# EAGLE design webserver (EAGLE 5.09)
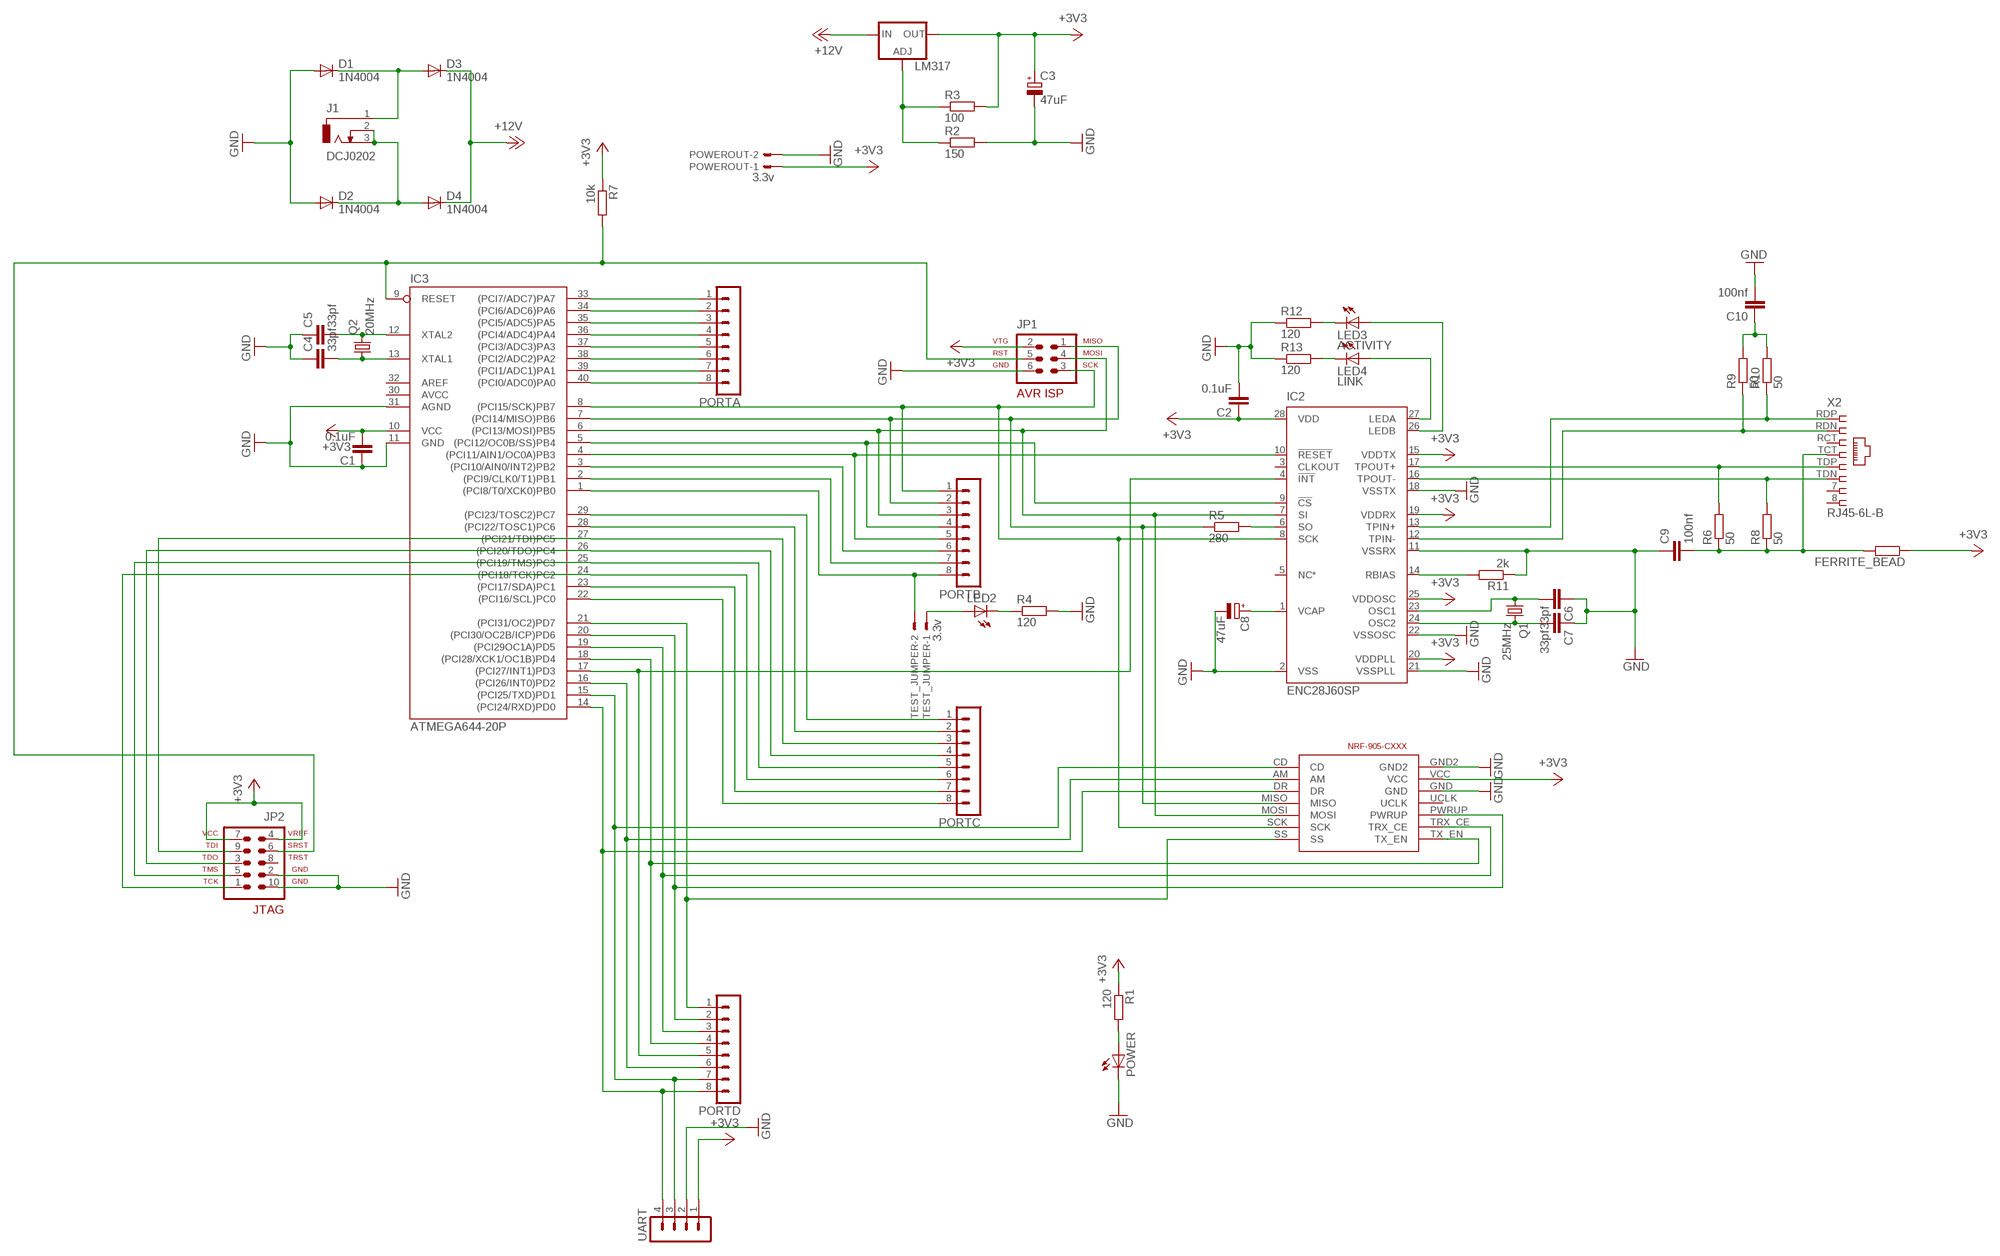
[diagram p0: schematic, sheet 1]

## Parts
C1  0.1uF  C-EU025-024X044  [C025-024X044]
C2  0.1uF  C-EU025-024X044  [C025-024X044]
C3  47uF  CPOL-EUE5-8.5  [E5-8,5]
C4  33pf  C-EU025-024X044  [C025-024X044]
C5  33pf  C-EU025-024X044  [C025-024X044]
C6  33pf  C-EU025-024X044  [C025-024X044]
C7  33pf  C-EU025-024X044  [C025-024X044]
C8  47uF  CPOL-EUE5-8.5  [E5-8,5]
C9  100nf  C-EU025-024X044  [C025-024X044]
C10  100nf  C-EU025-024X044  [C025-024X044]
D1  1N4004  [DO41-10]
D2  1N4004  [DO41-10]
D3  1N4004  [DO41-10]
D4  1N4004  [DO41-10]
FERRITE_BEAD  R-EU_0204/7  [0204/7]
IC2  ENC28J60SP  [DIL28-3]
IC3  ATMEGA644-20P  [DIL40]
J1  DCJ0202  [DCJ0202]
JP1  AVR-ISP-6  [AVR-ISP-6]
JP2  AVR-JTAG-10  [AVR-JTAG-10]
LED2  LED3MM  [LED3MM]
LED3  ACTIVITY  LED3MM  [LED3MM]
LED4  LINK  LED3MM  [LED3MM]
LM317  LM317TS  [317TS]
PORTA  MA08-1  [MA08-1]
PORTB  MA08-1  [MA08-1]
PORTC  MA08-1  [MA08-1]
PORTD  MA08-1  [MA08-1]
POWER  LED3MM  [LED3MM]
POWEROUT  3.3v  22-23-2021  [22-23-2021]
Q1  25MHz  CRYTALHC49S  [HC49/S]
Q2  20MHz  CRYTALHC49S  [HC49/S]
R1  120  R-EU_0204/7  [0204/7]
R2  150  R-EU_0204/7  [0204/7]
R3  100  R-EU_0204/7  [0204/7]
R4  120  R-EU_0204/7  [0204/7]
R5  280  R-EU_0204/7  [0204/7]
R6  50  R-EU_0204/7  [0204/7]
R7  10k  R-EU_0204/7  [0204/7]
R8  50  R-EU_0204/7  [0204/7]
R9  50  R-EU_0204/7  [0204/7]
R10  50  R-EU_0204/7  [0204/7]
R11  2k  R-EU_0204/7  [0204/7]
R12  120  R-EU_0204/7  [0204/7]
R13  120  R-EU_0204/7  [0204/7]
TEST_JUMPER  3.3v  22-23-2021  [22-23-2021]
U$1  NRF-905-CXXX  [NRF905-CXXX]
UART  MA04-1  [MA04-1]
X2  RJ45-6L-B  [RJ45-NO-SHIELD]

## Nets
+3V3: C1.2 C2.1 C3.+ FERRITE_BEAD.1 IC2.15(VDDTX) IC2.19(VDDRX) IC2.20(VDDPLL) IC2.25(VDDOSC) IC2.28(VDD) IC3.10(VCC) JP1.2 JP2.4 JP2.7 LM317.2(OUT) POWEROUT.1 R1.1 R3.2 R7.1 U$1.VCC UART.1
+12V: D3.C D4.C LM317.3(IN)
GND: C1.1 C2.2 C3.- C4.1 C5.1 C6.1 C7.1 C8.- C9.1 C10.2 D1.A D2.A IC2.2(VSS) IC2.11(VSSRX) IC2.18(VSSTX) IC2.21(VSSPLL) IC2.22(VSSOSC) IC3.11(GND) IC3.31(AGND) JP1.6 JP2.2 JP2.10 POWER.K(C) POWEROUT.2 R2.2 R4.2 R11.1 R12.1 R13.1 U$1.GND U$1.GND2 UART.2
N$1: IC3.29((PCI23/TOSC2)PC7) PORTC.1
N$2: IC3.28((PCI22/TOSC1)PC6) PORTC.2
N$3: IC3.27((PCI21/TDI)PC5) JP2.9 PORTC.3
N$4: IC3.26((PCI20/TDO)PC4) JP2.3 PORTC.4
N$5: IC3.25((PCI19/TMS)PC3) JP2.5 PORTC.5
N$6: IC3.24((PCI18/TCK)PC2) JP2.1 PORTC.6
N$7: IC3.23((PCI17/SDA)PC1) PORTC.7
N$8: IC3.22((PCI16/SCL)PC0) PORTC.8
N$9: IC3.33((PCI7/ADC7)PA7) PORTA.1
N$10: LM317.1(ADJ) R2.1 R3.1
N$11: IC2.9(!CS) IC3.5((PCI12/OC0B/SS)PB4) PORTB.4
N$12: IC3.7((PCI14/MISO)PB6) JP1.1 PORTB.2 R5.1 U$1.MISO
N$13: IC2.7(SI) IC3.6((PCI13/MOSI)PB5) JP1.4 PORTB.3 U$1.MOSI
N$14: POWER.A R1.2
N$15: IC3.21((PCI31/OC2)PD7) PORTD.1 U$1.SS
N$16: IC3.14((PCI24/RXD)PD0) PORTD.8 U$1.DR UART.4
N$17: IC2.8(SCK) IC3.8((PCI15/SCK)PB7) JP1.3 PORTB.1 U$1.SCK
N$18: C7.2 IC2.24(OSC2) Q1.2
N$19: C6.2 IC2.23(OSC1) Q1.1
N$20: IC3.9(RESET) JP1.5 JP2.6 R7.2
N$21: C8.+ IC2.1(VCAP)
N$23: C5.2 IC3.12(XTAL2) Q2.2
N$24: IC3.15((PCI25/TXD)PD1) PORTD.7 U$1.CD UART.3
N$25: IC2.10(!RESET) IC3.4((PCI11/AIN1/OC0A)PB3) PORTB.5
N$26: C4.2 IC3.13(XTAL1) Q2.1
N$27: IC3.34((PCI6/ADC6)PA6) PORTA.2
N$28: IC3.35((PCI5/ADC5)PA5) PORTA.3
N$29: IC3.36((PCI4/ADC4)PA4) PORTA.4
N$30: IC3.37((PCI3/ADC3)PA3) PORTA.5
N$31: IC3.38((PCI2/ADC2)PA2) PORTA.6
N$32: IC3.39((PCI1/ADC1)PA1) PORTA.7
N$33: IC3.40((PCI0/ADC0)PA0) PORTA.8
N$34: IC3.1((PCI8/T0/XCK0)PB0) PORTB.8 TEST_JUMPER.2
N$35: IC3.2((PCI9/CLK0/T1)PB1) PORTB.7
N$36: IC3.3((PCI10/AIN0/INT2)PB2) PORTB.6
N$37: IC2.6(SO) R5.2
N$38: IC3.20((PCI30/OC2B/ICP)PD6) PORTD.2 U$1.PWRUP
N$39: IC3.19((PCI29OC1A)PD5) PORTD.3 U$1.TRX_CE
N$40: IC3.18((PCI28/XCK1/OC1B)PD4) PORTD.4 U$1.TX_EN
N$41: IC2.4(!INT) IC3.17((PCI27/INT1)PD3) PORTD.5
N$42: IC3.16((PCI26/INT0)PD2) PORTD.6 U$1.AM
N$44: D2.C D4.A J1.2 J1.3
N$45: D1.C D3.A J1.1
N$46: LED2.K(C) R4.1
N$47: LED2.A TEST_JUMPER.1
N$48: C9.2 FERRITE_BEAD.2 R6.1 R8.1 X2.TCT
N$49: IC2.16(TPOUT-) R8.2 X2.TDN
N$50: IC2.17(TPOUT+) R6.2 X2.TDP
N$51: C10.1 R9.2 R10.2
N$52: IC2.13(TPIN+) R10.1 X2.RDP
N$53: IC2.12(TPIN-) R9.1 X2.RDN
N$54: IC2.14(RBIAS) R11.2
N$55: IC2.27(LEDA) LED4.A
N$56: IC2.26(LEDB) LED3.A
N$57: LED4.K(C) R13.2
N$58: LED3.K(C) R12.2
Unconnected: IC2.3(CLKOUT) IC2.5(NC*) JP2.8 U$1.UCLK X2.7 X2.8 X2.RCT

## Power pins joined to a net without a drawn wire
AREF: IC3.32(AREF)
AVCC: IC3.30(AVCC)

## Library data of the parts
C1 C2 C4-C7 C9 C10 = rcl:C-EU: CAPACITOR, European symbol
C3 C8 = rcl:CPOL-EU: POLARIZED CAPACITOR, European symbol
D1-D4 = diode:1N4004: DIODE general purpose rectifier, 1 A
FERRITE_BEAD R1-R13 = rcl:R-EU_: RESISTOR, European symbol
IC2 = microchip:ENC28J60: Stand-Alone Ethernet Controller with SPI Interface Source: http://ww1.microchip.com/downloads/en/DeviceDoc/39662c.pdf
IC3 = avr:ATMEGA644*P: MICROCONTROLLER 64 kBytes FLASH 4 kBytes SRAM 2 kBytes EEPROM DUAL USART 8-channel 10 bit ADC
J1 = con-jack:DCJ0202: DC POWER JACK Source: DCJ0202.pdf
JP1 = atmel-isp:AVR-ISP-6: AVR ISP-6 Serial Programming Header
JP2 = avr-4:AVR-JTAG-10: AVR JTAG Debug/Programming Header
LED2-LED4 POWER = led:LED: LED OSRAM: - CHIPLED LG R971, LG N971, LY N971, LG Q971, LY Q971, LO R971, LY R971 LH N974, LH R974 LS Q976, LO Q976, LY Q976 LO Q996 - Hyper CHIPLED LW Q18S LB Q993, LB Q99A, LB R99A - SideLED LS A670, LO A670, LY A670, LG A670, LP A670 LB A673, LV A673, LT A673, LW A673 LH A674 LY A675 LS A676, LA A676, LO A676, LY A676, LW A676 LS A679, LY A679, LG A679 - Hyper Micro SIDELED® LS Y876, LA Y876, LO Y876, LY Y876 LT Y87S - SmartLED LW L88C, LW L88S LB L89C, LB L89S, LG L890 LS L89K, LO L89K, LY L89K LS L896, LA L896, LO L896, LY L896 - TOPLED LS T670, LO T670, LY T670, LG T670, LP T670 LSG T670, LSP T670, LSY T670, LOP T670, LYG T670 LG T671, LOG T671, LSG T671 LB T673, LV T673, LT T673, LW T673 LH T674 LS T676, LA T676, LO T676, LY T676, LB T676, LH T676, LSB T676, LW T676 LB T67C, LV T67C, LT T67C, LS T67K, LO T67K, LY T67K, LW E67C LS E67B, LA E67B, LO E67B, LY E67B, LB E67C, LV E67C, LT E67C LW T67C LS T679, LY T679, LG T679 LS T770, LO T770, LY T770, LG T770, LP T770 LB T773, LV T773, LT T773, LW T773 LH T774 LS E675, LA E675, LY E675, LS T675 LS T776, LA T776, LO T776, LY T776, LB T776 LHGB T686 LT T68C, LB T68C - Hyper Mini TOPLED® LB M676 - Mini TOPLED Santana® LG M470 LS M47K, LO M47K, LY M47K Source: http://www.osram.convergy.de - LUMILED® LXK2-PW12-R00, LXK2-PW12-S00, LXK2-PW14-U00, LXK2-PW14-V00 LXK2-PM12-R00, LXK2-PM12-S00, LXK2-PM14-U00 LXK2-PE12-Q00, LXK2-PE12-R00, LXK2-PE12-S00, LXK2-PE14-T00, LXK2-PE14-U00 LXK2-PB12-K00, LXK2-PB12-L00, LXK2-PB12-M00, LXK2-PB14-N00, LXK2-PB14-P00, LXK2-PB14-Q00 LXK2-PR12-L00, LXK2-PR12-M00, LXK2-PR14-Q00, LXK2-PR14-R00 LXK2-PD12-Q00, LXK2-PD12-R00, LXK2-PD12-S00 LXK2-PH12-R00, LXK2-PH12-S00 LXK2-PL12-P00, LXK2-PL12-Q00, LXK2-PL12-R00 Source: www.luxeon.com
LM317 = v-reg:LM317TS: VOLTAGE REGULATOR
PORTA PORTB PORTC PORTD = con-lstb:MA08-1: PIN HEADER
POWEROUT TEST_JUMPER = con-molex:22-23-2021: .100" (2.54mm) Center Header - 2 Pin
Q1 Q2 = crystal:CRYTAL: CRYSTAL
U$1 = nrf905-Cxxx:NRF-905-CXXX
UART = con-lstb:MA04-1: PIN HEADER
X2 = con-tycoelectronics:RJ45: CORCOM Modular RJ Jacks No Shield Source: www.tycoelectronics.com .. ENG_DS_1654001_1099_RJ_L_0507.pdf

## Board
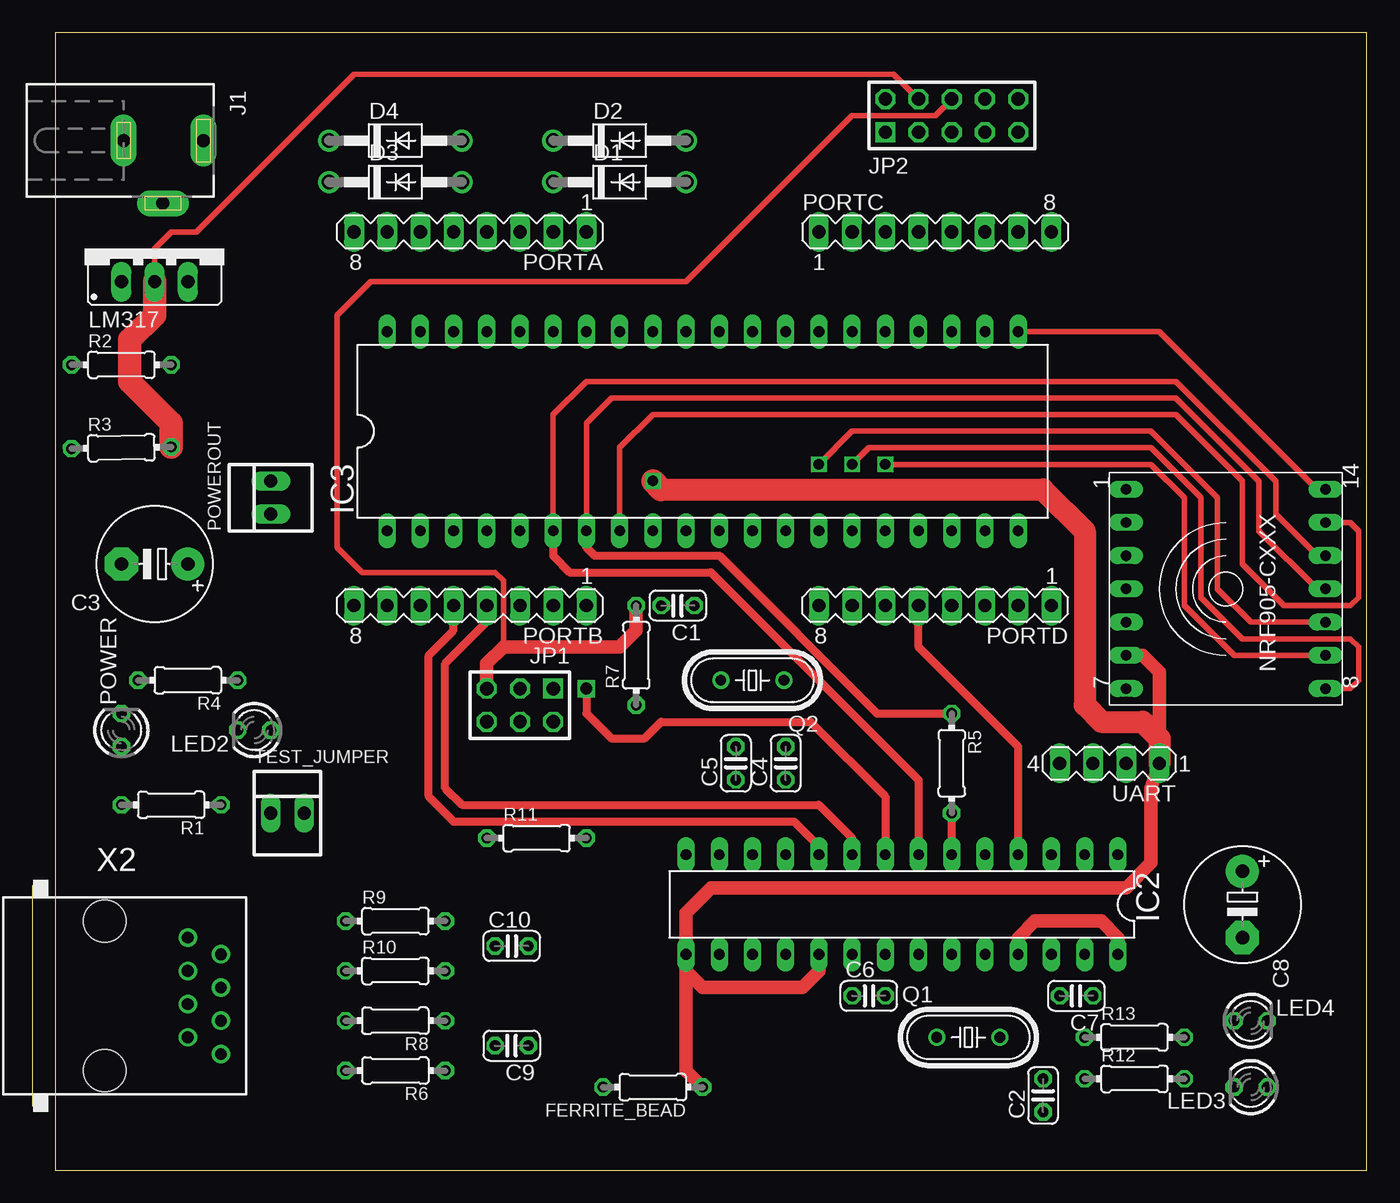
[diagram p1: board, top side]
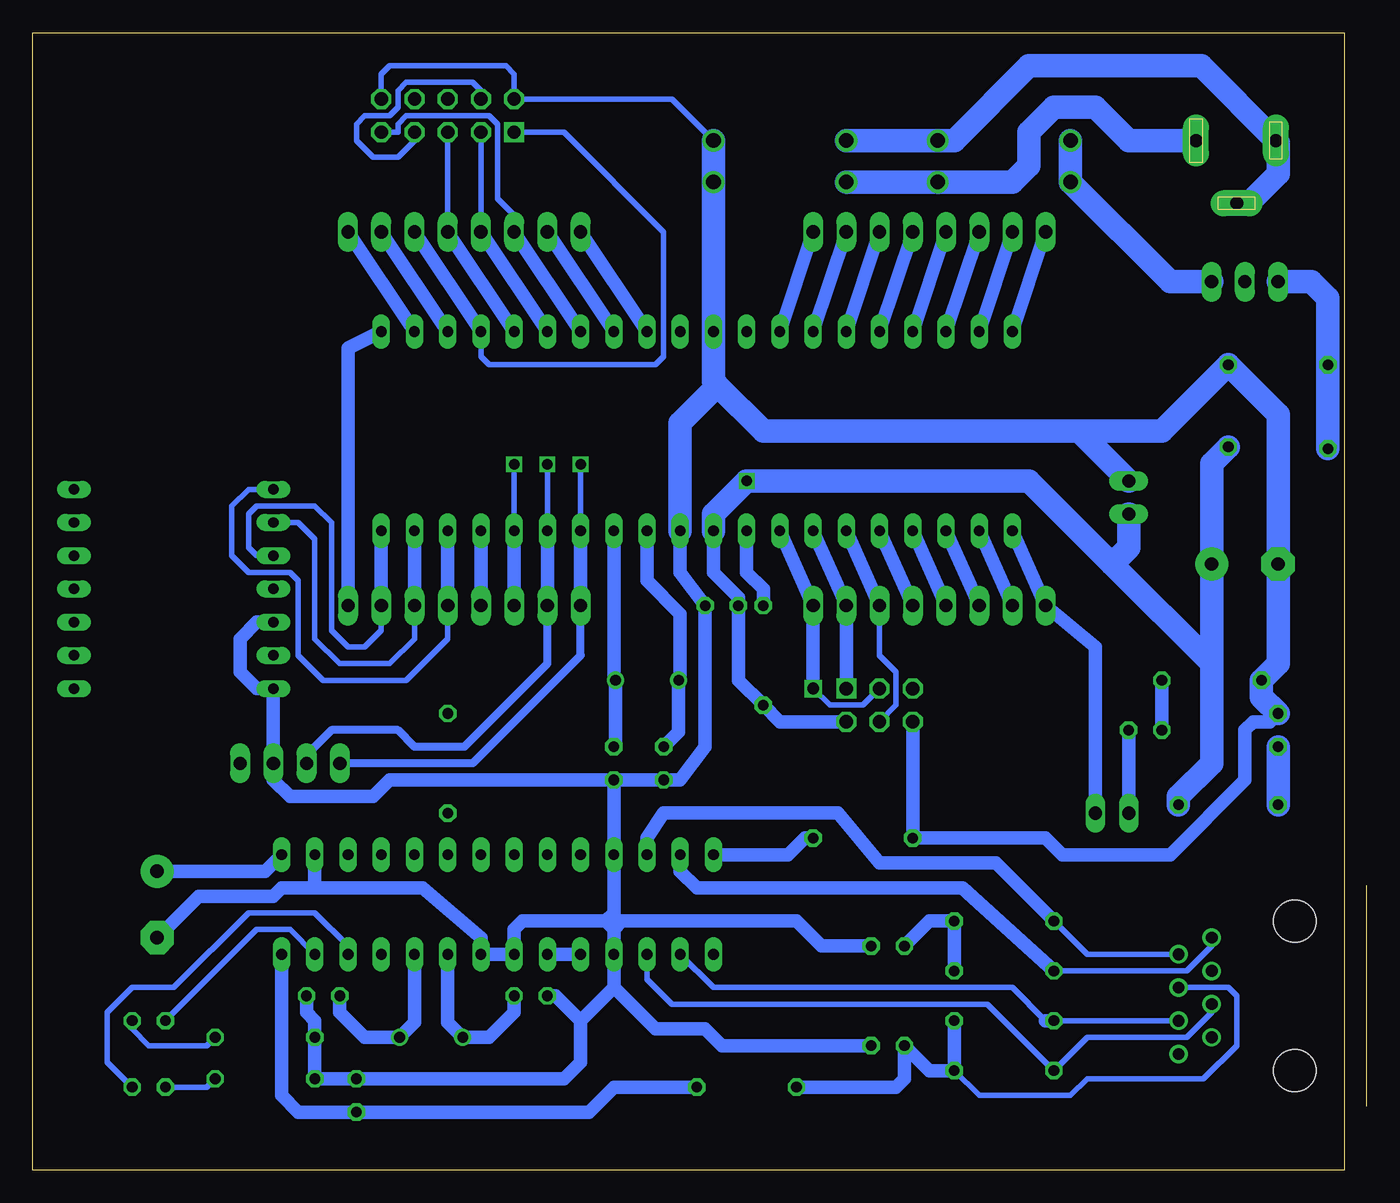
[diagram p2: board, bottom side, seen from below]

Size 100.3 x 86.98 mm. Coordinates in mm from the lower left corner, seen from the top.
Outline: 0,0 100.3,0 100.3,86.98 0,86.98 0,0
Copper layers (1*16): Top 0.035mm / dielectric 1.5mm / Bottom 0.035mm
Design rules "default": minimum track width 10mil, minimum drill 24mil, track to track 8mil, track to pad 8mil, pad to pad 8mil, via to via 8mil, smd to smd 8mil, copper to edge 10mil, drill to drill 8mil, minimum pad ring 10mil, minimum via ring 8mil, stop-mask expansion 4mil, vias tented up to drill 0mil, thermal gap 10mil

### Footprints (pad centres in the part's own frame; a part is rotated, then mirrored left to right if it is on the bottom)
C025-024X044 = drill 0.813 octagon: 1 -1.27,0; 2 1.27,0
E5-8,5 = drill 1.016 pad 2.54 round: + -2.54,0 | drill 1.016 pad 2.54 octagon: - 2.54,0
DO41-10 = drill 1.118 round: A 5.08,0; C -5.08,0
0204/7 = drill 0.813 octagon: 1 -3.81,0; 2 3.81,0
DIL28-3 = drill 0.813 long: 1 -16.51,-3.81; 2 -13.97,-3.81; 3 -11.43,-3.81; 4 -8.89,-3.81; 5 -6.35,-3.81; 6 -3.81,-3.81; 7 -1.27,-3.81; 8 1.27,-3.81; 9 3.81,-3.81; 10 6.35,-3.81; 11 8.89,-3.81; 12 11.43,-3.81; 13 13.97,-3.81; 14 16.51,-3.81; 15 16.51,3.81; 16 13.97,3.81; 17 11.43,3.81; 18 8.89,3.81; 19 6.35,3.81; 20 3.81,3.81; 21 1.27,3.81; 22 -1.27,3.81; 23 -3.81,3.81; 24 -6.35,3.81; 25 -8.89,3.81; 26 -11.43,3.81; 27 -13.97,3.81; 28 -16.51,3.81
DIL40 = drill 0.813 long: 1 -24.13,-7.62; 2 -21.59,-7.62; 3 -19.05,-7.62; 4 -16.51,-7.62; 5 -13.97,-7.62; 6 -11.43,-7.62; 7 -8.89,-7.62; 8 -6.35,-7.62; 9 -3.81,-7.62; 10 -1.27,-7.62; 11 1.27,-7.62; 12 3.81,-7.62; 13 6.35,-7.62; 14 8.89,-7.62; 15 11.43,-7.62; 16 13.97,-7.62; 17 16.51,-7.62; 18 19.05,-7.62; 19 21.59,-7.62; 20 24.13,-7.62; 21 24.13,7.62; 22 21.59,7.62; 23 19.05,7.62; 24 16.51,7.62; 25 13.97,7.62; 26 11.43,7.62; 27 8.89,7.62; 28 6.35,7.62; 29 3.81,7.62; 30 1.27,7.62; 31 -1.27,7.62; 32 -3.81,7.62; 33 -6.35,7.62; 34 -8.89,7.62; 35 -11.43,7.62; 36 -13.97,7.62; 37 -16.51,7.62; 38 -19.05,7.62; 39 -21.59,7.62; 40 -24.13,7.62
DCJ0202 = drill 1 pad 2 long: 1 0,3.1; 2 4.8,0; 3 0,-3
AVR-ISP-6 = drill 1.016 square: 1 -2.54,-1.27 | drill 1.016 octagon: 2 -2.54,1.27; 3 0,-1.27; 4 0,1.27; 5 2.54,-1.27; 6 2.54,1.27
AVR-JTAG-10 = drill 1.016 square: 1 -5.08,-1.27 | drill 1.016 octagon: 2 -5.08,1.27; 3 -2.54,-1.27; 4 -2.54,1.27; 5 0,-1.27; 6 0,1.27; 7 2.54,-1.27; 8 2.54,1.27; 9 5.08,-1.27; 10 5.08,1.27
LED3MM = drill 0.813 octagon: A -1.27,0; K 1.27,0
317TS = drill 1.016 long: 1 -2.54,-2.54; 2 0,-2.54; 3 2.54,-2.54
MA08-1 = drill 1.016 long: 1 -8.89,0; 2 -6.35,0; 3 -3.81,0; 4 -1.27,0; 5 1.27,0; 6 3.81,0; 7 6.35,0; 8 8.89,0
22-23-2021 = drill 1 long: 1 -1.27,0; 2 1.27,0
HC49/S = drill 0.813 round: 1 -2.413,0; 2 2.413,0
NRF905-CXXX = drill 0.8 long: AM -5.08,-7.62; CD -7.62,-7.62; DR -2.54,-7.62; GND -2.54,7.62; GND2 -7.62,7.62; MISO 0,-7.62; MOSI 2.54,-7.62; PWRUP 2.54,7.62; SCK 5.08,-7.62; SS 7.62,-7.62; TRX_CE 5.08,7.62; TX_EN 7.62,7.62; UCLK 0,7.62; VCC -5.08,7.62
MA04-1 = drill 1.016 long: 1 -3.81,0; 2 -1.27,0; 3 1.27,0; 4 3.81,0
RJ45-NO-SHIELD = drill 0.9 pad 1.4 round: 7 3.175,6.35; 8 4.445,8.89; RCT -1.905,6.35; RDN -3.175,8.89; RDP -4.445,6.35; TCT -0.635,8.89; TDN 1.905,8.89; TDP 0.635,6.35 | hole 3.251: -5.715,0; 5.715,0

### Placement (x,y rotation side)
C1  47.61,43.18 180 top
C2  75.55,5.71 90 top
C3  7.61,46.35 180 top
C4  55.87,31.11 90 top
C5  52.06,31.11 90 top
C6  62.22,13.33 0 top
C7  78.09,13.33 180 top
C8  90.79,20.31 270 top
C9  34.91,9.52 180 top
C10  34.91,17.14 0 top
D1  43.17,75.56 0 top
D2  43.17,78.73 0 top
D3  26.02,75.56 0 top
D4  26.02,78.73 0 top
FERRITE_BEAD  45.71,6.34 180 top
IC2  64.76,20.31 180 top
IC3  49.52,56.51 0 top
J1  8.24,78.73 270 top
JP1  35.55,35.55 180 top
JP2  68.57,80.64 0 top
LED2  15.23,33.65 180 top
LED3  91.43,6.34 180 top
LED4  91.43,11.43 0 top
LM317  7.61,70.48 0 top
PORTA  31.74,71.75 180 top
PORTB  31.74,43.18 180 top
PORTC  67.3,71.75 0 top
PORTD  67.3,43.18 180 top
POWER  5.07,33.65 90 top
POWEROUT  16.5,51.43 90 top
Q1  69.84,10.16 0 top
Q2  53.33,37.46 180 top
R1  8.88,27.94 180 top
R2  5.07,61.59 0 top
R3  5.07,55.24 1 top
R4  10.15,37.46 180 top
R5  68.57,31.11 270 top
R6  26.02,7.62 180 top
R7  44.44,39.37 90 top
R8  26.02,11.43 180 top
R9  26.02,19.05 0 top
R10  26.02,15.23 0 top
R11  36.82,25.4 0 top
R12  82.54,6.98 0 top
R13  82.54,10.16 0 top
TEST_JUMPER  17.77,27.3 0 top
U$1  89.52,44.45 90 top
UART  80.63,31.11 180 top
X2  3.8,13.33 270 top

### Tracks (layer width: path | path; a pad name or v marks a point on that pad's centre or on a via)
+3V3  (via drill 0.8)
  Top 0.406: JP2.4 64.12,83.81 22.85,83.81 10.78,71.75 8.88,71.75 7.61,70.48 LM317.2
  Top 1.016: IC2.19 58.41,15.23 57.14,13.96 49.52,13.96 48.25,15.23 IC2.15 | IC2.15 48.25,19.68 50.15,21.59 81.9,21.59 83.81,23.49 83.81,29.2 UART.1 84.44,38.09 83.17,39.37 U$1.VCC | IC2.25 73.65,17.77 74.92,19.05 80,19.05 81.27,17.77 IC2.28 | IC2.15 48.25,7.62 FERRITE_BEAD.1
  Top 1.676: UART.1 84.44,33.02 83.17,34.28 80,34.28 78.73,35.55 78.73,48.89 75.55,52.07 46.34,52.07
  Top 1.778: R3.2 8.88,57.15 5.7,60.32 5.7,63.5 7.61,65.4 LM317.2 | v45.71,52.7 46.34,52.07
  Bottom 0.406: JP2.7 71.11,78.73 72.38,77.47 74.28,77.47 75.55,78.73 75.55,80 74.92,80.64 73.01,80.64 72.38,81.28 72.38,82.55 71.74,83.18 66.66,83.18 66.03,82.55 JP2.4
  Bottom 1.016: IC2.19 IC2.20 | IC3.10 48.25,45.72 46.34,43.81 C1.2 46.34,37.46 R7.1 43.17,34.28 JP1.2 | IC2.28 81.27,5.71 80,4.44 C2.1 57.77,4.44 55.87,6.34 FERRITE_BEAD.1
  Bottom 1.778: 10.15,38.73 10.15,31.11 12.69,28.57 R1.1 | 10.15,38.73 C3.+ 10.15,54.04 R3.2 | 17.77,46.35 24.12,52.7 v45.71,52.7 48.25,50.16 IC3.10 | POWEROUT.1 16.5,47.62 17.77,46.35 | 10.15,38.73 17.77,46.35
+12V
  Bottom 1.778: D4.C D3.C 13.32,67.94 LM317.3
GND
  Bottom 0.406: JP2.10 73.65,83.81 73.01,84.45 64.12,84.45 63.49,83.81 JP2.2 51.42,81.91 D2.A
  Bottom 1.016: 55.87,13.96 IC2.18 55.87,18.41 | 55.87,13.96 58.41,11.43 | 78.73,21.59 70.47,21.59 66.03,17.77 IC2.22 IC2.21 63.49,18.41 62.85,19.05 56.5,19.05 | 78.73,21.59 IC2.2 | 78.73,21.59 81.27,21.59 81.9,20.95 87.62,20.95 C8.- | IC3.11 50.79,45.72 C1.1 48.88,32.38 50.79,29.84 C5.1 C4.1 | C10.2 39.99,17.14 41.9,19.05 55.23,19.05 55.87,18.41 | 58.41,11.43 58.41,8.25 59.68,6.98 C2.2 R12.1 R13.1 78.73,11.43 79.36,12.06 C7.1 | 56.5,19.05 55.87,18.41 | 56.5,19.05 55.87,19.68 IC2.11 C4.1 | C9.1 47.61,9.52 48.88,10.79 52.69,10.79 55.87,13.96 | JP1.6 R11.1 22.85,25.4 21.58,24.12 13.32,24.12 7.61,29.84 7.61,33.65 6.97,34.28 5.7,34.28 POWER.K | C6.1 60.31,13.33 58.41,11.43 | U$1.GND 83.17,41.91 84.44,40.64 84.44,38.09 83.17,36.83 U$1.GND2 UART.2 81.9,29.84 80.63,28.57 74.28,28.57 73.01,29.84 C4.1
  Bottom 1.778: 20.31,56.51 13.96,56.51 R2.2 5.07,57.78 C3.- 5.07,38.73 R4.2 6.34,36.19 POWER.K | 20.31,56.51 44.44,56.51 47.93,60 | 20.31,56.51 POWEROUT.2 | 47.93,60 48.25,60.32 IC3.31 D1.A D2.A | IC3.11 50.79,57.15 47.93,60
N$1
  Bottom 1.016: IC3.29 PORTC.1
N$2
  Bottom 1.016: IC3.28 PORTC.2
N$3
  Bottom 0.406: PORTC.3 63.49,73.02 64.76,74.29 64.76,80 65.39,80.64 71.74,80.64 72.38,80 72.38,79.37 JP2.9
  Bottom 1.016: IC3.27 PORTC.3
N$4
  Bottom 0.406: PORTC.4 JP2.3
  Bottom 1.016: IC3.26 PORTC.4
N$5
  Bottom 0.406: PORTC.5 JP2.5
  Bottom 1.016: IC3.25 PORTC.5
N$6
  Bottom 0.406: JP2.1 59.68,79.37 52.06,71.75 52.06,62.23 52.69,61.59 65.39,61.59 66.03,62.23 IC3.24
  Bottom 1.016: IC3.24 PORTC.6
N$7
  Bottom 1.016: IC3.23 PORTC.7
N$8
  Bottom 1.016: IC3.22 PORTC.8
N$9
  Bottom 1.016: IC3.33 PORTA.1
N$10
  Bottom 1.778: 1.26,66.67 2.53,67.94 LM317.1 | 1.26,66.67 R3.1 | 1.26,66.67 R2.1
N$11
  Top 0.61: IC2.9 60.95,25.4 58.41,27.94 31.1,27.94 29.83,29.2 29.83,38.73 33.01,41.91 PORTB.4
  Bottom 1.016: PORTB.4 IC3.5
N$12
  Top 0.406: U$1.MISO 96.51,44.45 92.06,48.89 92.06,52.7 85.71,59.05 42.53,59.05 40.63,57.15 IC3.7
  Top 0.61: IC3.7 40.63,47.62 41.26,46.98 50.79,46.98 62.85,34.92 R5.1
  Bottom 1.016: JP1.1 PORTB.2 IC3.7
N$13
  Top 0.406: U$1.MOSI 96.51,46.98 93.33,50.16 93.33,52.7 85.71,60.32 40.63,60.32 38.09,57.78 IC3.6
  Top 0.61: IC2.7 66.03,29.84 50.15,45.72 39.36,45.72 38.09,46.98 IC3.6
  Bottom 0.406: PORTB.3 35.55,39.37 34.28,38.09 34.28,35.55 JP1.4
  Bottom 1.016: PORTB.3 IC3.6
N$14
  Bottom 1.778: R1.2 POWER.A
N$15
  Top 0.406: U$1.SS 96.51,52.07 84.44,64.13 IC3.21
  Bottom 1.016: PORTD.1 76.19,62.86 IC3.21
N$16  (via drill 0.8 pad 0.81)
  Top 0.406: v58.41,53.97 60.95,56.51 83.81,56.51 88.89,51.43 88.89,44.45 91.43,41.91 U$1.DR
  Bottom 0.406: IC3.14 v58.41,53.97
  Bottom 0.61: UART.4 66.66,31.11 58.41,39.37 PORTD.8
  Bottom 1.016: PORTD.8 IC3.14
N$17  (via drill 0.9)
  Top 0.406: U$1.SCK 99.05,49.52 99.68,48.89 99.68,43.81 99.05,43.18 93.97,43.18 90.79,46.35 90.79,52.7 85.71,57.78 45.71,57.78 43.17,55.24 IC3.8
  Top 0.61: IC2.8 63.49,28.57 57.77,34.28 46.34,34.28 45.07,33.02 42.53,33.02 40.63,34.92 v40.63,36.83
  Bottom 0.406: v40.63,36.83 39.36,35.55 36.82,35.55 JP1.3
  Bottom 1.016: IC3.8 PORTB.1 v40.63,36.83
N$18
  Bottom 1.016: IC2.24 71.11,11.3 Q1.2 74.92,10.16 76.82,12.06 C7.2
N$19
  Bottom 1.016: IC2.23 68.57,11.3 Q1.1 65.39,10.16 63.49,12.06 C6.2
N$20
  Top 0.406: JP2.6 67.3,80.64 60.95,80.64 48.25,67.94 24.12,67.94 21.58,65.4 21.58,47.62 23.48,45.72 33.64,45.72 34.28,45.08 34.28,40
  Top 1.016: JP1.5 33.01,38.73 34.28,40 43.17,40 44.44,41.27 R7.2
  Bottom 1.016: R7.2 44.44,44.45 45.71,45.72 IC3.9
N$21
  Bottom 1.016: C8.+ 82.54,22.85 IC2.1
N$23
  Bottom 1.016: C5.2 50.91,33.52 Q2.2 50.79,37.59 50.79,42.54 53.33,45.08 IC3.12
N$24  (via drill 0.8 pad 0.61)
  Top 0.406: v60.95,53.97 62.22,55.24 83.81,55.24 87.62,51.43 87.62,43.81 90.79,40.64 99.05,40.64 99.68,40 99.68,37.46 99.05,36.83 U$1.CD
  Bottom 0.406: IC3.15 v60.95,53.97
  Bottom 0.61: UART.3 79.36,31.74 77.46,33.65 72.38,33.65 71.11,32.38 67.3,32.38 60.95,38.73 PORTD.7
  Bottom 1.016: PORTD.7 IC3.15
N$25
  Top 0.61: IC2.10 58.41,24.76 56.5,26.66 30.47,26.66 28.56,28.57 28.56,39.37 30.47,41.27 PORTB.5
  Bottom 1.016: PORTB.5 IC3.4
N$26
  Bottom 1.016: C4.2 55.74,32.51 Q2.1 55.87,37.59 IC3.13
N$27
  Bottom 1.016: IC3.34 PORTA.2
N$28
  Bottom 1.016: IC3.35 PORTA.3
N$29
  Bottom 1.016: IC3.36 PORTA.4
N$30
  Bottom 1.016: IC3.37 PORTA.5
N$31
  Bottom 1.016: IC3.38 PORTA.6
N$32
  Bottom 1.016: IC3.39 PORTA.7
N$33
  Bottom 1.016: IC3.40 PORTA.8
N$34
  Bottom 1.016: IC3.1 PORTB.8 19.04,40 TEST_JUMPER.2
N$35
  Bottom 1.016: PORTB.7 IC3.2
N$36
  Bottom 1.016: PORTB.6 IC3.3
N$37
  Top 0.61: IC2.6 R5.2
N$38
  Bottom 0.406: PORTD.2 73.65,41.27 74.92,40 76.19,40 77.46,41.27 77.46,49.52 78.73,50.8 83.17,50.8 83.81,50.16 83.81,47.62 83.17,46.98 U$1.PWRUP
  Bottom 1.016: PORTD.2 IC3.20
N$39
  Bottom 0.406: PORTD.3 71.11,40.64 73.01,38.73 76.82,38.73 78.73,40.64 78.73,48.26 80,49.52 U$1.TRX_CE
  Bottom 1.016: PORTD.3 IC3.19
N$40
  Bottom 0.406: U$1.TX_EN 83.81,52.07 85.08,50.8 85.08,46.98 83.81,45.72 80.63,45.72 80,45.08 80,39.37 78.09,37.46 71.74,37.46 68.57,40.64 PORTD.4
  Bottom 1.016: PORTD.4 IC3.18
N$41
  Top 0.61: IC2.4 73.65,32.38 66.03,40 PORTD.5
  Bottom 1.016: PORTD.5 IC3.17
N$42  (via drill 0.8)
  Top 0.406: U$1.AM 90.16,39.37 86.35,43.18 86.35,51.43 83.81,53.97 v63.49,53.97
  Bottom 0.406: IC3.16 v63.49,53.97
  Bottom 1.016: PORTD.6 IC3.16
N$44
  Bottom 1.778: D2.C D4.A 29.83,78.73 24.12,84.45 10.96,84.45 J1.3 5.07,78.56 5.07,76.2 7.33,73.94 J1.2
N$45
  Bottom 1.778: D1.C D3.A 25.39,75.56 24.12,76.83 24.12,79.37 22.21,81.28 19.04,81.28 16.5,78.73 J1.1
N$46
  Bottom 1.016: LED2.K R4.1
N$47
  Bottom 1.016: TEST_JUMPER.1 LED2.A
N$48
  Bottom 0.406: X2.TCT 8.88,13.96 8.24,13.33 8.24,9.52 10.78,6.98 19.67,6.98 20.94,5.71 27.93,5.71 R6.1
  Bottom 1.016: R8.1 R6.1 31.74,7.62 C9.2 33.64,6.98 34.28,6.34 FERRITE_BEAD.2
N$49
  Bottom 0.406: 22.85,11.43 25.39,13.96 48.25,13.96 IC2.16 | X2.TDN R8.2
  Bottom 1.016: R8.2 22.85,11.43
N$50
  Bottom 0.406: IC2.17 53.33,14.6 51.42,12.7 27.29,12.7 R6.2 19.67,10.16 12.05,10.16 10.15,12.06 X2.TDP
N$51
  Bottom 1.016: R10.2 R9.2 31.74,19.05 C10.1
N$52
  Bottom 0.406: X2.RDP 10.15,17.14 12.05,15.23 R10.1
  Bottom 1.016: IC2.13 50.79,22.85 49.52,21.59 29.2,21.59 R10.1
N$53
  Bottom 0.406: X2.RDN 19.67,16.51 R9.1
  Bottom 1.016: IC2.12 53.33,25.4 52.06,27.3 38.72,27.3 35.55,23.49 26.66,23.49 R9.1
N$54
  Bottom 1.016: R11.2 41.26,25.4 42.53,24.12 IC2.14
N$55
  Bottom 0.406: IC2.27 80.63,18.41 83.17,18.41 LED4.A
N$56
  Bottom 0.406: IC2.26 76.19,17.14 78.73,19.68 83.81,19.68 89.52,13.96 92.7,13.96 94.6,12.06 94.6,8.25 LED3.A
N$57
  Bottom 0.406: LED4.K 92.7,10.79 91.43,9.52 86.98,9.52 R13.2
N$58
  Bottom 0.406: LED3.K 86.98,6.34 R12.2